# EAGLE design DOORLOCK_v4 (EAGLE 7.6.0)

## Sheet 1 of 2
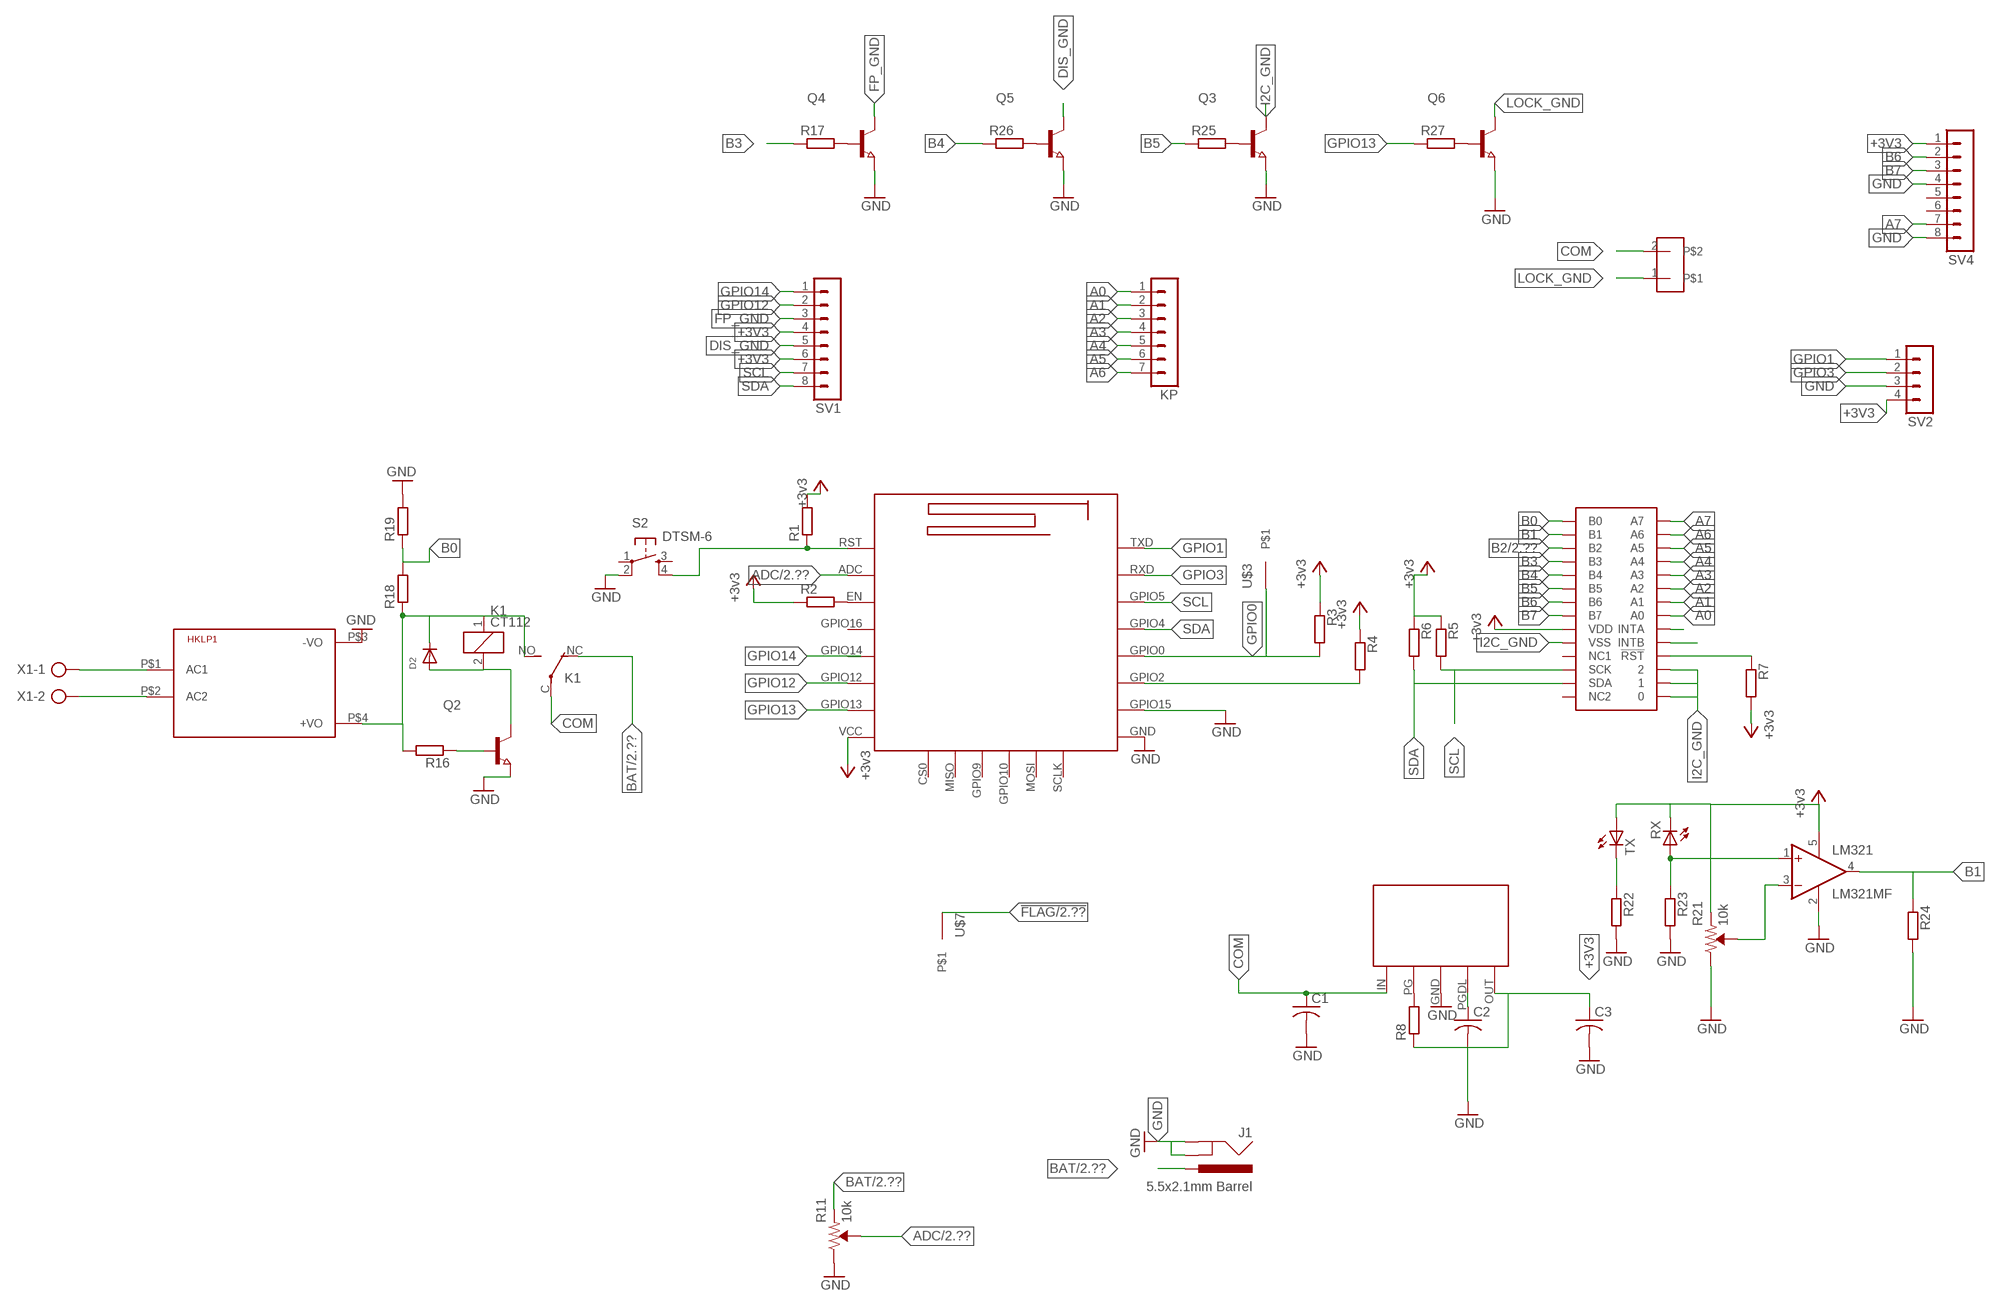
[diagram p0: schematic, sheet 1]

### Parts
C1  C-USC1206  [C1206]
C2  C-USC1206  [C1206]
C3  C-USC1206  [C1206]
D2  DIODESOD-123  [SOD-123]
HKLP1  HKLPM01  [HKLPM01]
J1  5.5x2.1mm Barrel  POWER_JACKSMD  [POWER_JACK_SMD]
K1  CT112  [CT-SLIM]
KP  MA07-1  [MA07-1]
LM321  LM321MF  [SOT23-5]
MCP23017  MCF23017  [MAX23017]
MP2014  MP2014  [MP2014]
Q2  NPN-TRANSISTOR_SOT89  [SOT89]
Q3  NPN-TRANSISTOR_SOT89  [SOT89]
Q4  NPN-TRANSISTOR_SOT89  [SOT89]
Q5  NPN-TRANSISTOR_SOT89  [SOT89]
Q6  NPN-TRANSISTOR_SOT89  [SOT89]
R1  R-EU_0204/2V  [0204V]
R2  R-EU_0204/2V  [0204V]
R3  R-EU_0204/2V  [0204V]
R4  R-EU_0204/2V  [0204V]
R5  R-EU_0204/2V  [0204V]
R6  R-EU_0204/2V  [0204V]
R7  R-EU_0204/2V  [0204V]
R8  R-EU_0204/2V  [0204V]
R11  10k  TRIMPOT-SMD-3MM-OPEN-1/10W-25%  [TRIMPOT-SMD-TC33X]
R16  R-EU_0204/2V  [0204V]
R17  R-EU_0204/2V  [0204V]
R18  R-EU_0204/2V  [0204V]
R19  R-EU_0204/2V  [0204V]
R21  10k  TRIMPOT-SMD-3MM-OPEN-1/10W-25%  [TRIMPOT-SMD-TC33X]
R22  R-EU_0204/2V  [0204V]
R23  R-EU_0204/2V  [0204V]
R24  R-EU_0204/2V  [0204V]
R25  R-EU_0204/2V  [0204V]
R26  R-EU_0204/2V  [0204V]
R27  R-EU_0204/2V  [0204V]
RX  LED5MM  [LED5MM]
S2  DTSM-6  [DTSM-6]
SV1  MA08-1  [MA08-1]
SV2  MA04-1  [MA04-1]
SV4  MA08-1  [MA08-1]
TX  LED5MM  [LED5MM]
U$1  ESP12E  [ESP-12E]
U$3  M1  [M1]
U$4  MALE2PIN  [MALE2PIN]
U$7  M1  [M1]
X1  AK500/2-H  [AK500/2-H]

### Nets
!FLAG [GPIO]: U$7.P$1 ; also sheet 2
+3V3 [GPIO]: C3.1 LM321.5(V+) MCP23017.P$9(VDD) MP2014.OUT R1.2 R2.1 R3.1 R4.1 R5.1 R6.1 R7.2 R8.1 R21.3(CCW) RX.K(C) SV1.4 SV1.6 SV2.4 SV4.1 TX.A U$1.VCC ; supply symbol labelled +3v3
+12V: D2.C HKLP1.P$4(+VO) K1.1 K1.NO(2:S) R16.2 R18.1 ; also sheet 2
A0 [GPIO]: KP.1 MCP23017.P$21(A0)
A1 [GPIO]: KP.2 MCP23017.P$22(A1)
A2 [GPIO]: KP.3 MCP23017.P$23(A2)
A3 [GPIO]: KP.4 MCP23017.P$24(A3)
A4 [GPIO]: KP.5 MCP23017.P$25(A4)
A5 [GPIO]: KP.6 MCP23017.P$26(A5)
A6 [GPIO]: KP.7 MCP23017.P$27(A6)
A7 [GPIO]: MCP23017.P$28(A7) SV4.7
ADC [GPIO]: R11.2(WIPER) U$1.ADC ; also sheet 2
B0 [GPIO]: MCP23017.P$1(B0) R18.2 R19.1
B1 [GPIO]: LM321.4(OUT) MCP23017.P$2(B1) R24.1
B2 [GPIO]: MCP23017.P$3(B2) ; also sheet 2
B3 [GPIO]: MCP23017.P$4(B3) R17.1
B4 [GPIO]: MCP23017.P$5(B4) R26.1
B5 [GPIO]: MCP23017.P$6(B5) R25.1
B6 [GPIO]: MCP23017.P$7(B6) SV4.2
B7 [GPIO]: MCP23017.P$8(B7) SV4.3
BAT [GPIO]: J1.VIN0(PWR) K1.NC(2:O) R11.3(CCW) ; also sheet 2
COM [GPIO]: C1.1 K1.C(2:P) MP2014.IN U$4.2
DIS_GND [GPIO]: Q5.2(C) SV1.5
FP_GND [GPIO]: Q4.2(C) SV1.3
GND [GPIO]: C1.2 C2.2 C3.2 HKLP1.P$3(-VO) J1.GND(GNDBREAK) J1.P$4(GND) LM321.2(V-) MP2014.GND Q2.3(E) Q3.3(E) Q4.3(E) Q5.3(E) Q6.3(E) R11.1(CW) R19.2 R21.1(CW) R22.2 R23.2 R24.2 S2.2 SV2.3 SV4.4 SV4.8 U$1.GND U$1.GPIO15 ; also sheet 2
GPIO0 [GPIO]: R3.2 U$1.GPIO0 U$3.P$1
GPIO1 [GPIO]: SV2.1 U$1.TXD
GPIO3 [GPIO]: SV2.2 U$1.RXD
GPIO12 [GPIO]: SV1.2 U$1.GPIO12
GPIO13 [GPIO]: R27.1 U$1.GPIO13
GPIO14 [GPIO]: SV1.1 U$1.GPIO14
I2C_GND [GPIO]: MCP23017.P$10(VSS) MCP23017.P$15 MCP23017.P$16 MCP23017.P$17 Q3.2(C)
LOCK_GND: Q6.2(C) U$4.1
N$1 [GPIO]: R1.1 S2.4 U$1.RST
N$2: R2.2 U$1.EN
N$3 [AC]: HKLP1.P$1(AC1) X1.1
N$4 [GPIO]: R4.2 U$1.GPIO2
N$5 [GPIO]: LM321.3(-IN) R21.2(WIPER)
N$6: Q3.1(B) R25.2
N$7 [AC]: HKLP1.P$2(AC2) X1.2
N$9 [GPIO]: MCP23017.P$18(!RST) R7.1
N$10: MCP23017.P$19(INTB)
N$11: MCP23017.P$20(INTA)
N$12: MP2014.PG R8.2
N$13: C2.1 MP2014.PGDL
N$15: Q2.1(B) R16.1
N$16: Q6.1(B) R27.2
N$26: D2.A K1.2 Q2.2(C)
N$28: Q4.1(B) R17.2
N$30 [GPIO]: R22.1 TX.K(C)
N$31: Q5.1(B) R26.2
N$33 [GPIO]: LM321.1(+IN) R23.1 RX.A
SCL [GPIO]: MCP23017.P$12(SCK) R5.2 SV1.7 U$1.GPIO5
SDA [GPIO]: MCP23017.P$13(SDA) R6.2 SV1.8 U$1.GPIO4
Unconnected: MCP23017.P$11(NC1) MCP23017.P$14(NC2) S2.1 S2.3 SV4.5 SV4.6 U$1.CS0 U$1.GPIO9 U$1.GPIO10 U$1.GPIO16 U$1.MISO U$1.MOSI U$1.SCLK

## Sheet 2 of 2
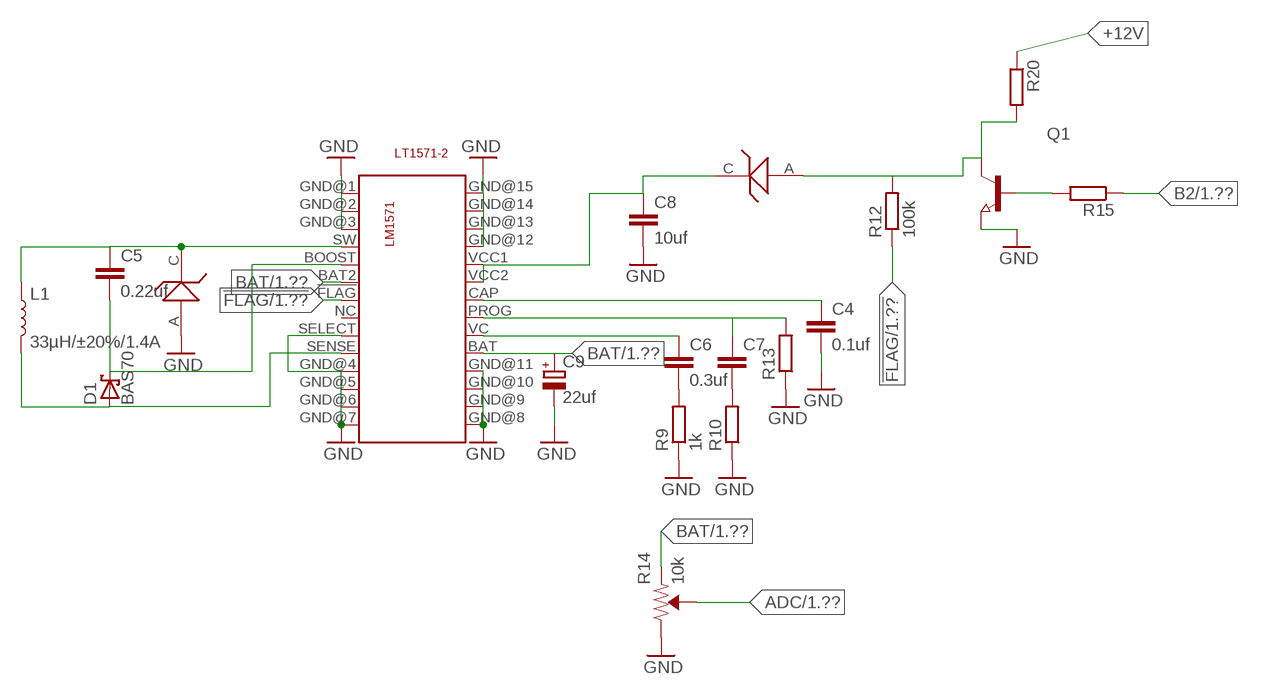
[diagram p1: schematic, sheet 2]

### Parts
C4  0.1uf  C-EUC0805  [C0805]
C5  0.22uf  C-EUC0805  [C0805]
C6  0.3uf  C-EUC0805  [C0805]
C7  C-EUC0805  [C0805]
C8  10uf  C-EUC0805  [C0805]
C9  22uf  CPOL-EUCT3216  [CT3216]
D1  BAS70  [SOT23]
D3  MBRM120T3  [MBRM120T3]
L1  33µH/±20%/1.4A  INDUCTOR-SRN6045-33UH  [SRN6045]
LT1571-2  LM1571  [LT1571]
Q1  NPN-TRANSISTOR_SOT89  [SOT89]
R9  1k  R-EU_0204/2V  [0204V]
R10  R-EU_0204/2V  [0204V]
R12  100k  R-EU_0204/2V  [0204V]
R13  R-EU_0204/2V  [0204V]
R14  10k  TRIMPOT-SMD-3MM-OPEN-1/10W-25%  [TRIMPOT-SMD-TC33X]
R15  R-EU_0204/2V  [0204V]
R20  R-EU_0204/2V  [0204V]
U$6  MBRM120T3  [MBRM120T3]

### Nets
!FLAG [GPIO]: LT1571-2.!FLAG R12.1 ; also sheet 1
+12V: R20.1 ; also sheet 1
ADC [GPIO]: R14.2(WIPER) ; also sheet 1
B2 [GPIO]: R15.1 ; also sheet 1
BAT [GPIO]: C9.+ LT1571-2.BAT LT1571-2.BAT2 R14.3(CCW) ; also sheet 1
GND [GPIO]: C4.2 C8.2 C9.- LT1571-2.GND@1 LT1571-2.GND@2 LT1571-2.GND@3 LT1571-2.GND@4 LT1571-2.GND@5 LT1571-2.GND@6 LT1571-2.GND@7 LT1571-2.GND@8 LT1571-2.GND@9 LT1571-2.GND@10 LT1571-2.GND@11 LT1571-2.GND@12 LT1571-2.GND@13 LT1571-2.GND@14 LT1571-2.GND@15 LT1571-2.SELECT Q1.3(E) R9.1 R10.1 R13.1 R14.1(CW) U$6.A ; also sheet 1
N$8 [GPIO]: Q1.1(B) R15.2
N$14: C8.1 D3.C LT1571-2.VCC1 LT1571-2.VCC2
N$17 [GPIO]: C4.1 LT1571-2.CAP
N$18: D3.A Q1.2(C) R12.2 R20.2
N$19: D1.1(A) L1.2 LT1571-2.SENSE
N$20: C5.1 L1.1 LT1571-2.SW U$6.C
N$21: C5.2 D1.3(C) LT1571-2.BOOST
N$22: C6.2 R9.2
N$23 [GPIO]: C6.1 LT1571-2.VC
N$24: C7.2 R10.2
N$25 [GPIO]: C7.1 LT1571-2.PROG R13.2
Unconnected: LT1571-2.NC

## Library data of the parts
C1-C3 = adafruit:C-US: CAPACITOR, American symbol
C4-C8 = rcl:C-EU: CAPACITOR, European symbol
C9 = rcl:CPOL-EU: POLARIZED CAPACITOR, European symbol
D1 = diode:BAS70: Silicon Schottky Diodes General-purpose diode for high-speed switching
D2 = adafruit:DIODE: Diode SMADIODE - SMA Surface Mount Package 20V 1A Schottky Diode Digikey: 641-1014-6-ND DO-1N4148 - Through Hole Small Current Diode SOD-123 20V 1 A (.5mV Vf) Schottky Diode - Digikey: MBRX120TPMSCT-ND SOD-323 10V 570mA (.38mV Vf, 3ns) Schottky Diode - Digikey: ZLLS410CT-ND SOD-523 30V 30mA Schottky Diode (RB751S-40TE61) - Digikey: RB751S-40TE61CT-ND SOT23-R/W - SOT23 Package (R = Solder Paste/Reflow Ovens, W = Hand-Soldering) BAT54Film 40V 300mA - Digikey: 497-7162-1-ND
D3 U$6 = Alfred:MBRM120T3
HKLP1 = HKLPM01:HKLPM01
J1 = SparkFun-Connectors:POWER_JACK: Power Jack Connector This is the standard 5.5mm barrel jack for power. The PTH is the most common, proven, reliable, footprint. The Slot footprint only works if the mill layer is transmitted to the PCB fab house so be warned. Here are the connectors we sell at SparkFun: DC Barrel Power Jack/Connector <https://www.sparkfun.com/products/119> (PRT-00119) DC Barrel Power Jack/Connector (SMD) <https://www.sparkfun.com/products/12748> (PRT-12748) DC Barrel Jack Adapter - Breadboard Compatible <https://www.sparkfun.com/products/10811> (PRT-10811) It is used on this SparkFun product (and many, many others): SparkFun RedBoard - Programmed with Arduino <https://www.sparkfun.com/products/12757> (DEV-12757) Also, if you need a mating power supply or connector, please check these out: Wall Adapter Power Supply - 9VDC 650mA <https://www.sparkfun.com/products/298> (TOL-00298) DC Barrel Jack Adapter - Male <https://www.sparkfun.com/products/10287> (PRT-10287); PROD_ID: CONN-08106; SF_ID: PRT-12748
K1 = relay:CT112: ULTRA SMALL AUTOMOTIVE RELAY NAiS Slim 1c type en_ds_61205_0000.pdf; OC_FARNELL: unknown; OC_NEWARK: unknown
KP = con-lstb:MA07-1: PIN HEADER; OC_FARNELL: unknown; OC_NEWARK: unknown
L1 = SparkFun-Coils:INDUCTOR: Inductors Resist changes in electrical current. Basically a coil of wire. SparkFun Products: SparkFun Load Cell Amplifier - HX711 <https://www.sparkfun.com/products/13879> IOIO-OTG - V2.2 <https://www.sparkfun.com/products/13613>; PROD_ID: NDUC-11627
LM321 = linear:LM321?*: Low Power Single Op Amp Source: http://cache.national.com/ds/LM/LM321.pdf
LT1571-2 = Alfred:LM1571
MCP23017 = Alfred:MCF23017
MP2014 = Alfred:MP2014
Q1-Q6 = semicon-smd-ipc:NPN-TRANSISTOR_: NPN TRANSISTOR
R1-R8 R16-R19 R22-R27 = resistor:R-EU_: RESISTOR, European symbol
R9 R10 R12 R13 R15 R20 = rcl:R-EU_: RESISTOR, European symbol
R11 R14 R21 = SparkFun-Resistors:TRIMPOT: Trimming Potentiometer (Trimpot) Three-terminal potentiometers, with an adjustable wiper and two adjustable resistors. A pot can be used to create a configurable voltage divider, or as a variable resistor. "Trimpots" are a subset of potentiometers, usually intended for "set-and-forget" applications. They're often more delicate than standard potentiometers - rated for fewer turns. Variants PTH-KNOB - PTH Trimpot w/ finger-adjustable knob Trimpot 10K with Knob <https://www.sparkfun.com/products/9806> (COM-09806) Datasheet <http://www.sparkfun.com/datasheets/Components/General/TSR-3386.pdf> SMD-3MM-CLOSED-FRAME - SMD 3mm Square Closed-Frame Trimpot Used on e.g. EasyDriver - Stepper Motor Driver <https://www.sparkfun.com/products/12779> Datasheet <http://www.bitechnologies.com/pdfs/22.pdf> (22AR10KTR) SMD-5MM - SMD 5mm Square Closed-Frame Trimpot Used on e.g. IOIO-OTG - V2.2 <https://www.sparkfun.com/products/13613> Datasheet <http://www.vishay.com/docs/51008/ts53.pdf> (TS53YL502MR10) SMD-3MM-1/10W-25% - 3mm Square Open-Frame Trimpot Used on e.g. SparkFun Shapeoko <https://www.sparkfun.com/products/13899> Datasheet <http://www.bourns.com/docs/Product-Datasheets/TC33.pdf> (TC33X-2-103E); PROD_ID: RES-12428
RX TX = adafruit:LED: LED OSRAM: - CHIPLED LG R971, LG N971, LY N971, LG Q971, LY Q971, LO R971, LY R971 LH N974, LH R974 LS Q976, LO Q976, LY Q976 LO Q996 - Hyper CHIPLED LW Q18S LB Q993, LB Q99A, LB R99A - SideLED LS A670, LO A670, LY A670, LG A670, LP A670 LB A673, LV A673, LT A673, LW A673 LH A674 LY A675 LS A676, LA A676, LO A676, LY A676, LW A676 LS A679, LY A679, LG A679 - Hyper Micro SIDELED® LS Y876, LA Y876, LO Y876, LY Y876 LT Y87S - SmartLED LW L88C, LW L88S LB L89C, LB L89S, LG L890 LS L89K, LO L89K, LY L89K LS L896, LA L896, LO L896, LY L896 - TOPLED LS T670, LO T670, LY T670, LG T670, LP T670 LSG T670, LSP T670, LSY T670, LOP T670, LYG T670 LG T671, LOG T671, LSG T671 LB T673, LV T673, LT T673, LW T673 LH T674 LS T676, LA T676, LO T676, LY T676, LB T676, LH T676, LSB T676, LW T676 LB T67C, LV T67C, LT T67C, LS T67K, LO T67K, LY T67K, LW E67C LS E67B, LA E67B, LO E67B, LY E67B, LB E67C, LV E67C, LT E67C LW T67C LS T679, LY T679, LG T679 LS T770, LO T770, LY T770, LG T770, LP T770 LB T773, LV T773, LT T773, LW T773 LH T774 LS E675, LA E675, LY E675, LS T675 LS T776, LA T776, LO T776, LY T776, LB T776 LHGB T686 LT T68C, LB T68C - Hyper Mini TOPLED® LB M676 - Mini TOPLED Santana® LG M470 LS M47K, LO M47K, LY M47K Source: http://www.osram.convergy.de/
S2 = switch-tact:DTSM-6
SV1 SV4 = con-lstb:MA08-1: PIN HEADER; OC_FARNELL: unknown; OC_NEWARK: unknown
SV2 = con-lstb:MA04-1: PIN HEADER; OC_FARNELL: unknown; OC_NEWARK: unknown
U$1 = Alfred:ESP12E
U$3 U$7 = Alfred:M1
U$4 = Alfred:MALE2PIN
X1 = con-ptr500:AK500/2-H: CONNECTOR Aug. 2004 / PTR Meßtechnik: Die Bezeichnung der Serie AK505 wurde geändert. Es handelt sich hierbei um AK500 in horizontaler Ausführung.; OC_FARNELL: unknown; OC_NEWARK: unknown

## Net classes
0 default: width 0.381 mm, drill 0.7 mm, clearance 0.203 mm
1 AC: width 1 mm, drill 0.7 mm, clearance 0.203 mm to class 0, clearance 0.203 mm
2 GPIO: width 0.254 mm, drill 0.7 mm, clearance 0.203 mm to class 0, clearance 0.203 mm to class 1, clearance 0.203 mm
3 zerocross: width 0.35 mm, drill 0.7 mm, clearance 0.203 mm to class 0, clearance 0.203 mm to class 1, clearance 0.203 mm to class 2, clearance 0.203 mm

## Board
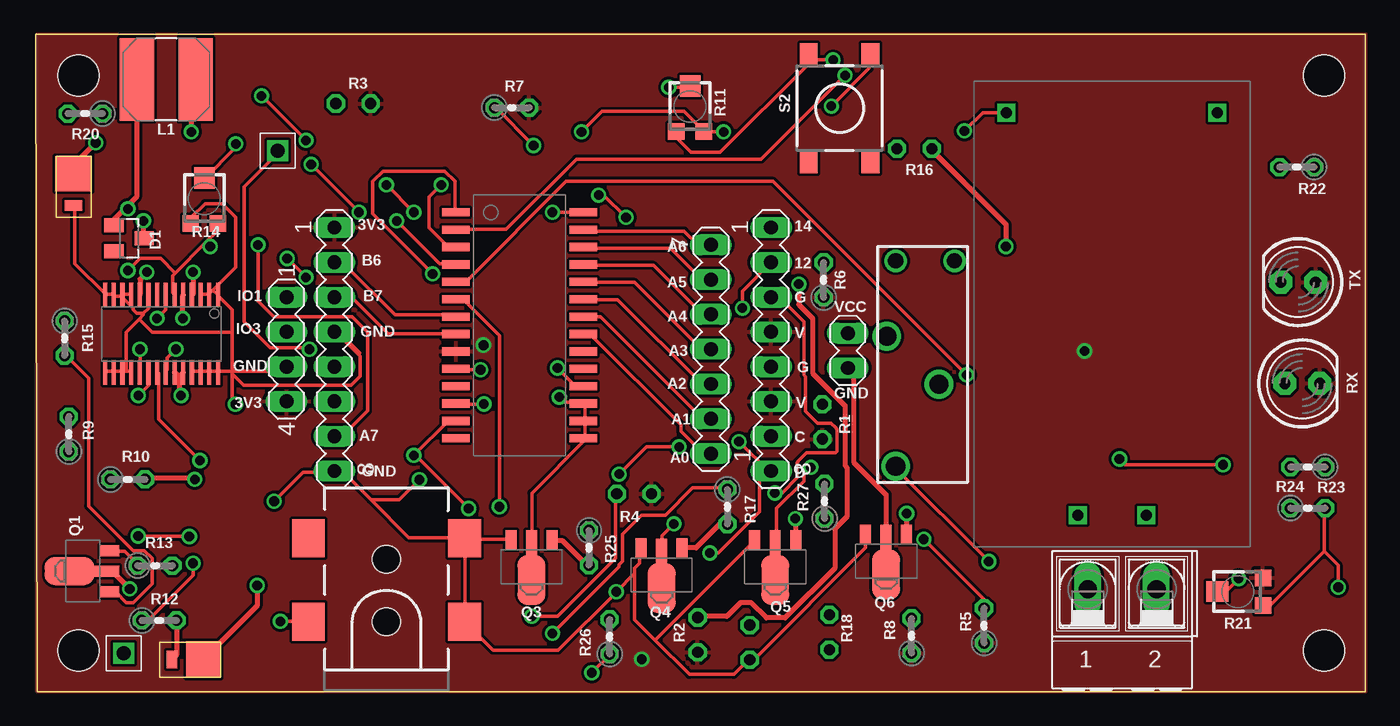
[diagram p2: board, top side]
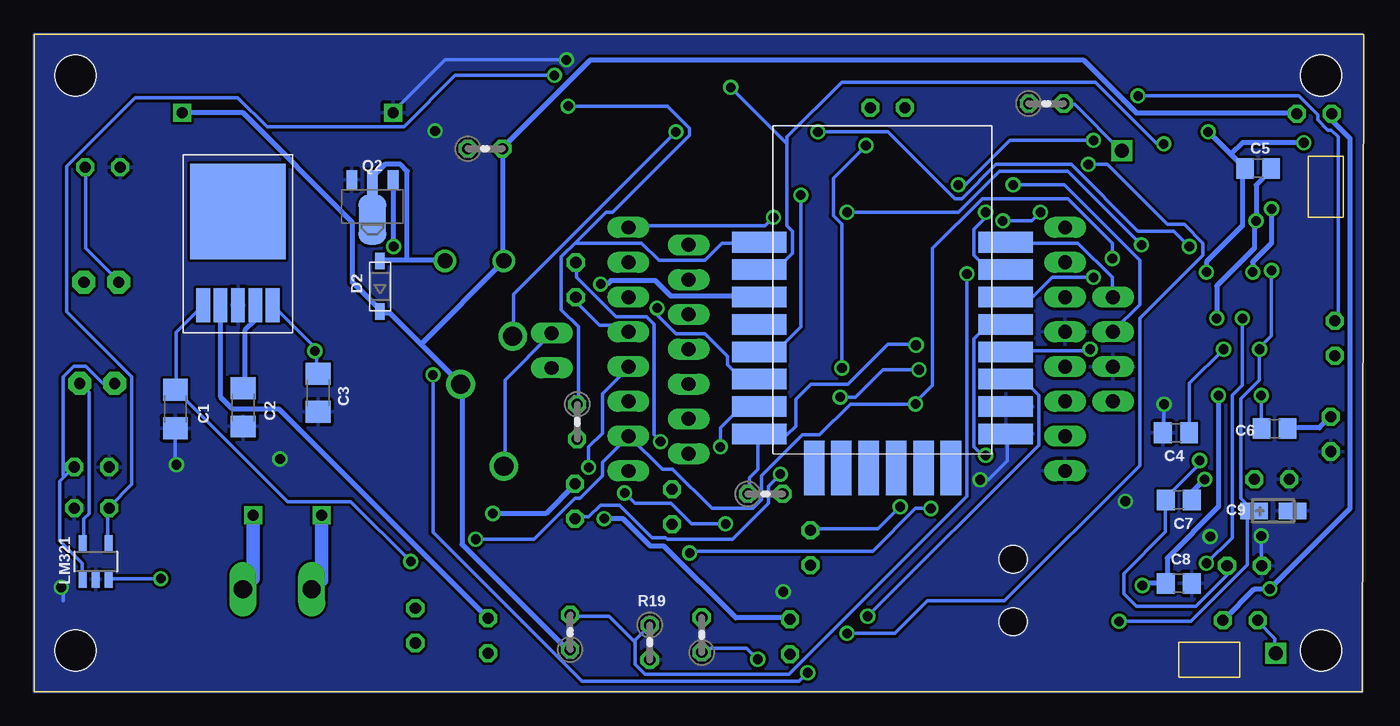
[diagram p3: board, bottom side, seen from below]

Size 97.1 x 48 mm. Coordinates in mm from the lower left corner, seen from the top.
Outline: 0,48 0.1,0 97.1,0 97.1,48 0,48
Copper layers (1*16): Top 0.035mm / dielectric 1.5mm / Bottom 0.035mm
Design rules "default *": minimum track width 0.2mm, minimum drill 0.4mm, track to track 0.1mm, track to pad 0.1mm, pad to pad 0.1mm, via to via 0.1mm, smd to smd 0.1mm, copper to edge 0mil, drill to drill 8mil, minimum pad ring 10mil, minimum via ring 8mil, stop-mask expansion 4mil, vias tented up to drill 0mil, thermal gap 10mil
Holes 3 mm at 94.1,45 3.1,45 3.1,3 94.1,3

### Footprints (pad centres in the part's own frame; a part is rotated, then mirrored left to right if it is on the bottom)
C1206 = smd 1.6 x 1.8: 1 -1.4,0; 2 1.4,0
C0805 = smd 1.3 x 1.5: 1 -0.95,0; 2 0.95,0
CT3216 = smd 2 x 1.2: + -1.4,0; - 1.4,0
SOT23 = smd 1 x 1.4: 1 -0.95,-1.1; 2 0.95,-1.1; 3 0,1.1
SOD-123 = smd 1.2 x 0.7: A 1.85,0; C -1.85,0
MBRM120T3 = smd 0.762 x 1.27: A 3.575,1.27 | smd 2.54 x 2.67: C 1.27,1.27
HKLPM01 = drill 0.8 square: P$1 -14.7,2.5; P$2 -14.7,-2.5; P$3 14.7,7.7; P$4 14.7,-7.7
POWER_JACK_SMD = smd 2.8 x 2.4: GND 0,-5.7; P$4 6.1,-5.7; VIN0 0,5.7; VIN1 6.1,5.7 | hole 2.032: 0,0; 4.572,0
CT-SLIM = drill 1.1: 1 -7.45,0; 2 -7.45,4.3 | drill 1.4: C 7.55,0; NC -1.95,-0.65; NO 1.55,3.15
MA07-1 = drill 1.016 long: 1 -7.62,0; 2 -5.08,0; 3 -2.54,0; 4 0,0; 5 2.54,0; 6 5.08,0; 7 7.62,0
SRN6045 = smd 2.5 x 6: 1 -2.175,0; 2 2.125,0
SOT23-5 = smd 0.6 x 1.2: 1 -0.95,-1.306; 2 0,-1.306; 3 0.95,-1.306; 4 0.95,1.306; 5 -0.95,1.306
LT1571 = smd 0.3 x 1.8: !FLAG 3.81,-0.864; BAT 5.715,4.809; BAT2 3.175,-0.864; BOOST 2.54,-0.864; CAP 3.81,4.809; GND@1 0,-0.864; GND@2 0.635,-0.864; GND@3 1.27,-0.864; GND@4 6.35,-0.864; GND@5 6.985,-0.864; GND@6 7.62,-0.864; GND@7 8.255,-0.864; GND@8 8.255,4.809; GND@9 7.62,4.809; GND@10 6.985,4.809; GND@11 6.35,4.809; GND@12 1.905,4.809; GND@13 1.27,4.809; GND@14 0.635,4.809; GND@15 0,4.809; NC 4.445,-0.864; PROG 4.445,4.809; SELECT 5.08,-0.864; SENSE 5.715,-0.864; SW 1.905,-0.864; VC 5.08,4.809; VCC1 2.54,4.809; VCC2 3.175,4.809
MAX23017 = smd 0.6 x 2: P$1 0,0; P$2 1.27,0; P$3 2.54,0; P$4 3.81,0; P$5 5.08,0; P$6 6.35,0; P$7 7.62,0; P$8 8.89,0; P$9 10.16,0; P$10 11.43,0; P$11 12.7,0; P$12 13.97,0; P$13 15.24,0; P$14 16.51,0; P$15 16.51,9.3; P$16 15.24,9.3; P$17 13.97,9.3; P$18 12.7,9.3; P$19 11.43,9.3; P$20 10.16,9.3; P$21 8.89,9.3; P$22 7.62,9.3; P$23 6.35,9.3; P$24 5.08,9.3; P$25 3.81,9.3; P$26 2.54,9.3; P$27 1.27,9.3; P$28 0,9.3
MP2014 = smd 1 x 2.5: GND 0,0; IN -2.54,0; OUT 2.54,0; PG -1.27,0; PGDL 1.27,0 | smd 7 x 7: P$6 0,6.85
SOT89 = smd 0.8 x 1.4: 1 -1.499,-1.981; 3 1.499,-1.981 | smd 0.8 x 1.9: 2 0,-1.727 | smd 2.032 x 3.65: 2@1 0,0.94
0204V = drill 0.813 octagon: 1 -1.27,0; 2 1.27,0
TRIMPOT-SMD-TC33X = smd 1.2 x 1.2: 1 -1,-1.825; 3 1,-1.825 | smd 1.5 x 1.6: 2 0,1.5
LED5MM = drill 0.813 pad 1.676 octagon: A -1.27,0; K 1.27,0
DTSM-6 = smd 1.55 x 1.3: 1 -3.975,2.25; 2 3.975,2.25; 3 -3.975,-2.25; 4 3.975,-2.25
MA08-1 = drill 1.016 long: 1 -8.89,0; 2 -6.35,0; 3 -3.81,0; 4 -1.27,0; 5 1.27,0; 6 3.81,0; 7 6.35,0; 8 8.89,0
MA04-1 = drill 1.016 long: 1 -3.81,0; 2 -1.27,0; 3 1.27,0; 4 3.81,0
ESP-12E = smd 4 x 1.5: ADC -8.62,3.32; EN -8.62,1.32; GND 9.38,-8.68; GPIO0 9.38,-2.68; GPIO2 9.38,-4.68; GPIO4 9.38,-0.68; GPIO5 9.38,1.32; GPIO12 -8.62,-4.68; GPIO13 -8.62,-6.68; GPIO14 -8.62,-2.68; GPIO15 9.38,-6.68; GPIO16 -8.62,-0.68; RST -8.62,5.32; RXD 9.38,3.32; TXD 9.38,5.32; VCC -8.62,-8.68 | smd 1.5 x 4: CS0 -4.62,-11.16; GPIO9 -0.62,-11.16; GPIO10 1.38,-11.16; MISO -2.62,-11.16; MOSI 3.38,-11.16; SCLK 5.38,-11.16
M1 = drill 1.016 square: P$1 0,0
MALE2PIN = drill 1.016 long: 1 0,1.27; 2 0,-1.27
AK500/2-H = drill 1.321 long: 1 -2.515,0; 2 2.515,0

### Placement (x,y rotation side)
C1  86.79,20.64 270 bottom
C2  81.84,20.76 270 bottom
C3  76.36,21.82 270 bottom
C4  13.7,18.9 180 bottom
C5  7.7,38.2 0 bottom
C6  6.5,19.2 0 bottom
C7  13.5,14 0 bottom
C8  13.5,7.9 0 bottom
C9  6.6,13.2 0 bottom
D1  6.8,33.1 270 top
D2  71.84,29.59 90 bottom
D3  13.5,3.6 180 top
HKLP1  78.6,27.58 90 top
J1  25.6,5.1 90 top
K1  62.8,24 270 top
KP  49.3,25 90 top
L1  9.5,44.7 180 top
LM321  92.6,9.5 0 bottom
LT1571-2  13.3,28.1 180 top
MCP23017  30.68,35 270 top
MP2014  82.22,28.21 0 bottom
Q1  3.4,8.8 90 top
Q2  72.4,35.4 180 bottom
Q3  36.2,9.1 180 top
Q4  45.7,8.5 180 top
Q5  54,9.1 180 top
Q6  62.1,9.5 180 top
R1  57.44,19.71 270 bottom
R2  48.34,4.14 90 bottom
R3  23.18,42.94 0 bottom
R4  43.7,14.44 0 bottom
R5  69.26,4.82 90 top
R6  57.54,30.06 90 top
R7  34.76,42.64 0 top
R8  63.96,4.08 90 top
R9  2.4,18.8 90 top
R10  6.7,15.5 0 top
R11  47.78,42.72 0 top
R12  9,5.2 0 top
R13  8.7,9.2 0 top
R14  12.3,36 0 top
R15  2.1,25.8 270 top
R16  64.17,39.64 0 bottom
R17  50.5,13.5 270 top
R18  57.96,4.33 90 bottom
R19  52.14,3.59 270 bottom
R20  3.6,42.2 180 top
R21  87.8,7.3 90 top
R22  92.1,38.3 180 top
R23  92.9,16.4 180 top
R24  92.9,13.4 0 top
R25  40.4,10.5 270 top
R26  41.9,4 90 top
R27  57.6,13.9 90 top
RX  92.5,22.5 0 top
S2  58.7,42.6 90 top
SV1  53.7,25 270 top
SV2  18.3,25 270 top
SV4  21.8,25 270 top
TX  92.2,29.9 180 top
U$1  35.52,27.49 0 bottom
U$3  17.66,39.49 90 top
U$4  59.3,24.9 180 top
U$6  1.48,39.08 270 top
U$7  6.4,2.8 0 top
X1  79.34,7.47 0 top

### Tracks (layer width: path | path; a pad name or v marks a point on that pad's centre or on a via)
!FLAG  (via drill 0.7)
  Top 0.254: v8.85,27.25 9.47,27.88 9.47,28.88 LT1571-2.!FLAG | v11.47,9.38 11.47,8.5 8.22,5.25 7.85,5.25 R12.1
  Bottom 0.254: v8.85,27.25 8.85,22.38 9.6,21.62 9.6,11.25 v11.47,9.38 | U$7.P$1 6.47,2.88 6.47,3.88 7.72,5.12 R12.1
+3V3  (via drill 0.7, 0.71)
  Top 0.254: 48.6,2.82 48.6,3 R2.1 48.36,2.86 48.29,2.82 | v32.69,25.3 32.61,25.3 32.59,25.32
  Bottom 0.254: 76.47,24.88 76.47,25 79.6,28.12 MP2014.OUT | 76.47,24.88 76.47,23.25 C3.1 | LM321.5 93.47,10.88 93.47,12.62 93.1,13 93.1,21.88 93.72,22.5 RX.K | 44.23,18.75 44.23,16.25 44.85,15.62 44.85,14.5 R4.1 | 44.23,18.75 U$1.VCC | v76.6,24.88 76.47,24.88 | R6.1 57.54,28.48 55.8,26.75 54.18,26.75 SV1.4 | 44.22,2.36 v44.25,2.36 45.06,3.17 48.34,3.17 R2.1 | 44.23,18.75 42.11,18.75 41.48,19.38 41.48,21.34 40.36,22.45 37.67,22.45 34.75,25.38 32.76,25.38 v32.69,25.3
  pour Top: 97.1,48 97.1,0 0.1,0 0.1,48
+12V
  Bottom 0.381: 68.85,25.38 65.97,22.5 K1.NO 65.85,22.38 65.85,10.75 58.23,3.12 57.98,3.12 R18.1 | 68.85,25.38 71.1,27.62 71.72,27.62 D2.C 71.85,27.88 73.85,29.88 73.85,34.25 81.85,42.25 86.22,42.25 HKLP1.P$4 | R20.1 4.97,42.25 16.6,42.25 20.48,46.12 56.48,46.12 62.85,39.75 R16.2 62.85,39.62 62.85,31.5 K1.1 62.85,31.38 68.85,25.38
A0
  Top 0.254: MCP23017.P$21 40.1,26 40.6,26 47.1,19.5 47.1,19 48.6,17.5 49.23,17.5 KP.1
A1
  Top 0.254: MCP23017.P$22 40.1,27.38 41.23,27.38 48.6,20 49.23,20 KP.2
A2
  Top 0.254: MCP23017.P$23 40.1,28.62 42.48,28.62 48.6,22.5 49.23,22.5 KP.3
A3
  Top 0.254: KP.4 48.6,25 43.73,29.88 40.1,29.88 MCP23017.P$24
A4
  Top 0.254: MCP23017.P$25 40.1,31.12 45.1,31.12 48.6,27.62 49.23,27.62 KP.5
A5
  Top 0.254: MCP23017.P$26 40.1,32.38 46.35,32.38 48.6,30.12 49.23,30.12 KP.6
A6
  Top 0.254: MCP23017.P$27 40.1,33.62 47.35,33.62 48.35,32.62 49.23,32.62 KP.7
A7  (via drill 0.7)
  Top 0.254: v37.73,35 MCP23017.P$28 | v16.23,32.62 16.23,28.5 17.35,27.38 23.1,27.38 24.23,26.25 24.23,20.5 22.48,18.75 21.85,18.75 SV4.7
  Bottom 0.254: v37.73,35 29.6,35 26.6,38 21.6,38 v16.23,32.62
ADC  (via drill 0.7)
  Top 0.254: v14.6,40 14.6,39.75 12.35,37.5 R14.2 | v46.23,44.12 47.73,44.12 R11.2
  Bottom 0.254: v14.6,40 15.1,40 19.6,44.5 38.1,44.5 42.1,40.5 42.1,40.12 | 42.1,40.12 42.1,34 41.73,33.62 41.73,32 42.85,30.88 44.1,30.88 U$1.ADC | v46.23,44.12 42.23,40.12 42.1,40.12
B0  (via drill 0.7)
  Top 0.254: v28.98,30.5 24.6,34.88 24.6,37.25 25.35,38 29.85,38 30.6,37.25 30.6,35 MCP23017.P$1
  Bottom 0.254: v28.98,30.5 28.98,14.25 41.98,1.25 52.48,1.25 53.23,2 53.23,3.75 | 53.23,3.75 52.23,4.75 R19.1 | R18.2 57.85,5.5 55.1,5.5 53.35,3.75 53.23,3.75
B1  (via drill 0.7)
  Top 0.254: v59.1,45 52.98,38.88 39.48,38.88 34.35,33.75 30.73,33.75 MCP23017.P$2
  Bottom 0.254: LM321.4 91.72,10.88 91.72,13.38 R24.1 91.6,13.5 89.97,15.12 89.97,23 94.72,27.75 94.72,38.38 89.72,43.38 82.22,43.38 80.1,41.25 70.1,41.25 66.35,45 v59.1,45
B2  (via drill 0.7)
  Top 0.254: v29.6,37 28.73,36.12 28.73,33.88 30.1,32.5 30.6,32.5 MCP23017.P$3 | v16.48,43.5 v19.73,40.25
  Bottom 0.254: v29.6,37 29.1,37 25.85,40.25 v19.73,40.25 | v16.48,43.5 4.72,43.5 3.35,42.12 3.35,41.75 2.6,41 2.35,41 1.85,40.5 1.85,27.38 2.1,27.12 R15.1
B3  (via drill 0.7)
  Top 0.254: v26.35,34.38 29.48,31.25 30.6,31.25 MCP23017.P$4 | v20.1,38.5 v23.6,35 | v37.73,4.25 42.6,9.12 42.6,9.25 42.85,9.5 42.85,11.5 44.23,12.88 45.98,12.88 47.98,14.88 50.48,14.88 R17.1
  Bottom 0.254: v26.35,34.38 24.23,34.38 v23.6,35 | v20.1,38.5 18.73,38.5 14.35,34.12 13.1,34.12 11.72,32.75 11.72,31.88 16.35,27.25 16.35,16.5 26.23,6.62 31.85,6.62 34.23,4.25 v37.73,4.25
B4  (via drill 0.7)
  Top 0.254: v67.97,23.12 53.85,37.25 38.73,37.25 31.48,30 30.73,30 MCP23017.P$5 | v40.6,1.38 41.85,2.62 R26.1
  Bottom 0.254: v67.97,23.12 67.97,11.62 57.1,0.75 41.23,0.75 v40.6,1.38
B5  (via drill 0.7)
  Top 0.254: v33.85,13.5 33.85,26 31.23,28.62 30.73,28.62 MCP23017.P$6
  Bottom 0.254: v33.85,13.5 35.48,11.88 40.35,11.88 R25.1
B6
  Top 0.254: MCP23017.P$7 30.6,27.5 26.23,27.5 22.48,31.25 21.85,31.25 SV4.2
B7
  Top 0.254: MCP23017.P$8 30.6,26.12 25.73,26.12 23.1,28.75 21.85,28.75 SV4.3
BAT  (via drill 0.7)
  Top 0.254: v50.23,40.88 48.85,40.88 R11.3 48.73,41 47.35,42.38 41.35,42.38 v39.85,40.88 | 10.16,30.56 9.97,30.38 9.97,29.12 10.1,29 LT1571-2.BAT2 | 10.16,30.56 12.41,32.81 | 12.41,32.81 13.22,33.62 13.22,34.12 R14.3 | v7.6,25 7.6,23.38 LT1571-2.BAT | v17.85,5.12 19.85,5.12 J1.VIN0 | 10.16,30.56 9.1,31.62 7.6,31.62 v6.72,30.75 | 12.41,32.81 v12.72,32.5
  Bottom 0.254: v50.23,40.88 62.1,29 62.1,26 K1.NC | v17.85,5.12 12.6,5.12 8.47,9.25 8.47,13.5 C9.+ 8.1,13.25 8.97,14.12 8.97,21.38 7.6,22.75 v7.6,25 7.6,25.12 6.72,26 v6.72,30.75 | v39.85,40.88 34.73,40.88 29.85,36 29.35,36 26.85,38.5 21.35,38.5 16.48,33.62 13.85,33.62 v12.72,32.5
COM  (via drill 0.7)
  Top 0.254: v69.6,9.5 62.73,16.38 K1.C
  Bottom 0.254: MP2014.IN 84.85,28.12 86.72,26.25 86.72,22.12 C1.1 86.72,22 78.6,13.88 73.97,13.88 v69.6,9.5 | U$4.2 59.35,26.12 62.73,22.75 62.73,16.5 K1.C
DIS_GND  (via drill 0.7)
  Top 0.254: v56.6,16.38 56.1,15.88 56.1,15.38 54.1,13.38 54.1,10.88 Q5.2
  Bottom 0.254: v56.6,16.38 56.6,17.88 55.6,18.88 55.6,21.75 53.73,23.62 SV1.5
FP_GND  (via drill 0.7)
  Top 0.254: v46.6,12.25 45.73,11.38 45.73,10.25 Q4.2 | v53.98,14.5 54.48,14.5 55.57,15.6 55.57,16.71 55.65,16.79 55.65,16.82 56.29,17.45 58.39,17.45 58.5,17.55 58.5,19.15 58.42,19.23 58.42,19.25 58.06,19.61 57.1,19.61 56.23,20.48 56.23,23 56.1,23.12 56.1,27 54.35,28.75 53.73,28.75 SV1.3
  Bottom 0.254: v46.6,12.25 49.1,12.25 50.6,13.75 53.23,13.75 v53.98,14.5
GND  (via drill 0.7, 0.71)
  Top 0.254: R11.1 46.85,40.88 46.85,40.38 47.85,39.38 49.98,39.38 56.35,45.75 56.35,46.5 S2.2 56.48,46.12 v58.23,46.12 | Q3.3 34.6,11.12 31.35,11.12 J1.P$4 | J1.P$4 31.35,11 31.35,5.12 J1.GND 33.38,3.02 38.15,3.02 42.39,7.26 v42.39,7.29 43.73,8.62 | LT1571-2.GND@8 5.1,23.38 5.6,23.38 LT1571-2.GND@9 5.72,23.38 6.22,23.38 LT1571-2.GND@10 6.35,23.38 6.6,23.38 | 6.6,23.38 6.85,23.38 LT1571-2.GND@11 | 5.1,29 5.6,29 LT1571-2.GND@6 5.72,28.88 6.22,28.88 | 5.1,29 LT1571-2.GND@7 | LT1571-2.GND@4 6.85,29 6.35,29 LT1571-2.GND@5 6.22,28.88 | 7.85,27.62 8.22,28 8.22,28.88 LT1571-2.SELECT | 7.85,27.62 7.35,27.62 7.1,27.88 7.1,28 6.22,28.88 | 6.6,23.38 6.6,26.25 7.54,27.19 | 7.54,27.19 7.85,27.5 7.85,27.62 | 12.6,29 12.91,29.31 | 12.91,29.31 14.6,31 14.6,34.62 13.6,35.62 12.35,35.62 11.35,34.62 11.35,34.25 R14.1 | 12.6,29 LT1571-2.GND@2 | 12.6,29 12.1,29 LT1571-2.GND@3 | 12.91,29.31 13.22,29 LT1571-2.GND@1 13.35,28.88 14.35,27.88 14.35,26.25 | LT1571-2.GND@12 11.47,23.38 11.97,23.38 LT1571-2.GND@13 12.1,23.38 12.6,23.38 LT1571-2.GND@14 12.72,23.38 13.22,23.38 LT1571-2.GND@15 13.35,23.38 14.35,23.38 | 94.1,10.25 90.22,6.38 89.72,6.38 R21.1 | 94.1,10.25 94.1,13.38 R24.2 | Q1.3 5.47,10.25 6.47,10.25 7.47,9.25 R13.1 | 43.73,8.62 43.73,5.25 45.23,3.75 | 45.23,3.75 47.73,1.25 50.98,1.25 52.1,2.38 R19.2 52.23,2.38 52.48,2.38 60.6,10.5 60.6,11.38 Q6.3 | Q4.3 44.1,10.38 44.1,9.38 43.73,9 43.73,8.62 | 45.23,3.75 52.48,11 Q5.3 | 14.35,23.38 17.98,23.38 18.23,23.62 SV2.3 | 14.35,23.38 14.35,26.25 | 7.54,27.19 8.47,26.25 14.35,26.25 | 24.48,13.99 22.48,16 21.87,16 21.85,16 | 24.48,13.99 27.23,11.25 31.23,11.25 J1.P$4
  Top 0.254: 21.85,16 SV4.8 | HKLP1.P$3 69.15,42.28 v67.82,40.95 | v86.71,16.56 79.58,16.56 v79.14,16.99 | 94.1,10.25 95.12,9.23 v95.12,7.62 | 5.1,29 2.84,31.26 2.84,35.6 U$6.A | v7.47,11.35 7.49,11.33 v11.2,11.33 | v14.58,20.98 14.35,21.21 14.35,23.22 | 14.35,23.22 14.35,23.38 | v28.02,15.47 26.54,13.99 24.48,13.99 | 23.57,24.71 23.57,24.59 23.67,24.49 23.67,23.04 23.01,22.38 15.19,22.38 14.35,23.22 | 21.85,16 19.5,16 v17.4,13.89
  Top 0.381: SV4.4 22.01,26.27 23.57,24.71
  Bottom 0.254: v58.23,46.12 67.1,46.12 70.85,42.38 HKLP1.P$3 | 12.45,8 12.6,8 C8.2 12.1,8 | 12.1,8 | v67.82,40.95 67.82,40.89 | C1.2 86.79,16.64 v86.71,16.56 | v79.14,16.99 79.14,17.07 79.09,17.12 | v95.12,7.62 94.97,7.47 94.97,6.63 | 7.47,9.25 7.47,9.26 v7.47,11.35 | v11.2,11.33 11.33,11.2 11.33,11.1 | C4.2 14.58,18.97 v14.58,20.98 | v28.02,15.47 27.41,15.47 26.03,16.84 26.03,18.7 U$1.GND 26.14,18.73 26.01,18.68 | v42.39,7.29 42.39,7.19 | v17.4,13.89 17.17,13.89 17.09,13.82
  pour Bottom: 97.1,48 97.1,0 0.1,0 0.1,48
GPIO0  (via drill 0.7)
  Top 0.254: v19.98,25 19.85,25.12 17.1,25.12 15.22,27 15.22,36.88 17.73,39.38 U$3.P$1
  Bottom 0.254: R3.2 21.85,42.88 21.1,42.88 17.73,39.5 U$3.P$1 | v19.98,25 20.1,24.88 26.1,24.88 U$1.GPIO0
GPIO1
  Bottom 0.254: SV2.1 18.35,28.88 18.35,30.25 20.85,32.75 26.1,32.75 U$1.TXD
GPIO3  (via drill 0.7)
  Top 0.254: v27.6,35 v25.6,37
  Bottom 0.254: v25.6,37 21.85,37 16.35,31.5 16.35,28.25 18.23,26.38 SV2.2 | v27.6,35 27.6,34.62 28.48,33.75 28.48,31.88 27.48,30.88 26.23,30.88 U$1.RXD
GPIO12  (via drill 0.7)
  Top 0.254: SV1.2 51.6,29.25 v51.6,28
  Bottom 0.254: v51.6,28 51.6,27.5 50.23,26.12 48.1,26.12 46.48,24.5 46.48,23.88 45.48,22.88 44.23,22.88 U$1.GPIO12
GPIO13  (via drill 0.7)
  Top 0.254: v42.6,15.88 44.6,17.88 v46.98,17.88
  Bottom 0.254: v42.6,15.88 43.48,15 43.48,13.75 46.1,11.12 50.85,11.12 50.98,11.25 51.98,11.25 54.35,13.62 55.73,13.62 56.6,12.75 57.6,12.75 R27.1 | v46.98,17.88 46.98,19.25 45.48,20.75 44.23,20.75 U$1.GPIO13
GPIO14  (via drill 0.7)
  Top 0.254: v43.1,34.62 41.48,36.25 v41.1,36.25
  Bottom 0.254: v43.1,34.62 43.73,34 53.6,34 SV1.1 | v41.1,36.25 41.1,26.62 42.85,24.88 44.1,24.88 U$1.GPIO14
I2C_GND  (via drill 0.7)
  Top 0.254: Q3.2 36.23,10.88 36.23,14.5 40.1,18.38 MCP23017.P$15 40.1,18.5 40.1,19.75 MCP23017.P$16 40.1,19.88 40.1,21 MCP23017.P$17 39.98,21.12 38.6,21.12 v38.23,21.5 | v32.48,23.5 30.73,23.5 MCP23017.P$10
  Bottom 0.254: v32.48,23.5 35.1,23.5 37.1,21.5 v38.23,21.5
LOCK_GND
  Top 0.381: Q6.2 62.1,14.38 59.73,16.75 59.73,23.25 59.35,23.62 U$4.1
N$1  (via drill 0.7)
  Top 0.254: v58.1,42.75 60.85,45.5 60.85,46.5 S2.4
  Bottom 0.254: v58.1,42.75 50.85,42.75 49.23,41.12 49.23,40.62 54.85,35 55.35,35 57.54,32.81 | 57.54,32.81 58.6,31.75 58.6,27.88 57.35,26.62 57.35,21 R1.1 | U$1.RST 44.23,32.75 46.85,32.75 48.1,31.5 51.48,31.5 52.73,32.75 57.48,32.75 57.54,32.81
N$2  (via drill 0.7)
  Top 0.381: v55.73,29.75 55.73,28.25 56.73,27.25 56.73,23.25 59.1,20.88 59.1,16.5 59.23,16.38 59.23,12.75 58.35,11.88 58.35,9 54.73,5.38 53.35,5.38 52.23,6.5 51.48,6.5 50.48,5.5 48.35,5.5 R2.2
  Bottom 0.381: v55.73,29.75 55.23,29.75 54.98,30 51.73,30 50.6,28.88 44.23,28.88 U$1.EN
N$3
  Bottom 1: HKLP1.P$1 76.1,8.12 76.72,7.5 X1.1
N$4  (via drill 0.7)
  Top 0.254: v36.23,5.5 38.1,5.5 42.35,9.75 42.35,14.38 R4.2
  Bottom 0.254: v36.23,5.5 23.73,18 23.73,21.62 24.85,22.75 26.1,22.75 U$1.GPIO2
N$5  (via drill 0.7)
  Top 0.254: v87.85,8.25 86.97,7.38 86.35,7.38 R21.2
  Bottom 0.254: v87.85,8.25 91.6,8.25 LM321.3
N$6
  Top 0.381: Q3.1 37.73,11 38.48,11 40.35,9.12 R25.2
N$7
  Bottom 1: HKLP1.P$2 81.1,8.25 81.85,7.5 X1.2
N$8
  Top 0.254: Q1.1 5.47,7.25 5.85,7.25 6.6,6.5 7.1,6.5 8.47,7.88 8.47,9.73 7.92,10.29 7.11,10.29 3.85,13.55 3.85,22.88 2.1,24.62 R15.2
N$9  (via drill 0.7)
  Top 0.254: v38.1,23.62 39.35,22.38 39.98,22.38 MCP23017.P$18 | v36.35,39.88 33.6,42.62 R7.1
  Bottom 0.254: v38.1,23.62 38.1,34.12 38.73,34.75 38.73,37.5 v36.35,39.88
N$12
  Bottom 0.381: MP2014.PG 83.47,28.12 83.47,21.5 82.6,20.62 79.22,20.62 63.98,5.38 R8.2
N$13
  Bottom 0.381: C2.1 81.72,22.25 81.72,26.38 80.97,27.12 80.97,28.12 MP2014.PGDL
N$14  (via drill 0.7, 0.71)
  Top 0.381: v10.6,21.62 10.47,21.75 10.47,23 | 10.47,23 10.22,23.25 LT1571-2.VCC2 | LT1571-2.VCC1 10.72,23.25 10.47,23 | v16.15,7.75 16.15,6.25 D3.C
  Bottom 0.381: v10.6,21.62 10.6,13.5 14.35,9.75 14.35,8 C8.1 16,7.9 v16.15,7.75
N$15  (via drill 0.7)
  Top 0.381: v70.85,32.5 70.85,34.12 65.35,39.62 R16.1
  Bottom 0.381: v70.85,32.5 70.85,37.38 Q2.1
N$16  (via drill 0.7)
  Top 0.381: v63.6,13 63.6,11.5 Q6.1
  Bottom 0.381: v63.6,13 59.73,13 57.6,15.12 R27.2
N$17  (via drill 0.7)
  Top 0.254: v10.22,25 9.6,24.38 9.6,23.5 9.47,23.38 LT1571-2.CAP
  Bottom 0.254: v10.22,25 12.72,22.5 12.72,19 C4.1
N$18  (via drill 0.7)
  Top 0.381: v6.85,7.5 5.6,8.75 5.22,8.75 Q1.2 | R12.2 10.27,2.67 D3.A
  Bottom 0.381: R12.2 10.22,5.25 7.97,7.5 v6.85,7.5 0.97,13.38 0.97,40.38 2.23,41.62 2.23,42.12 R20.2
N$19  (via drill 0.7)
  Top 0.381: 6.6,35.38 7.35,36.12 7.35,44.62 L1.2 | 6.6,35.38 5.72,34.5 5.72,34.12 D1.1 | v8.1,30.62 7.6,30.12 7.6,29 LT1571-2.SENSE | v6.72,35.25 6.6,35.38
  Bottom 0.381: v8.1,30.62 8.1,31.38 6.72,32.75 v6.72,35.25
N$20  (via drill 0.7, 0.71)
  Top 0.381: v11.35,40.88 11.35,44.38 L1.1 | v11.47,30.62 11.47,29 LT1571-2.SW | U$6.C 2.75,38.47 v4.37,40.08
  Bottom 0.381: v11.35,40.88 9.7,39.22 | 9.7,39.22 8.72,38.25 C5.1 8.85,38.12 8.85,34 11.47,31.38 v11.47,30.62 | v4.37,40.08 8.84,40.08 9.7,39.22
N$21  (via drill 0.7)
  Top 0.381: v7.85,34.38 7.85,33.12 D1.3 | v10.72,27.25 10.72,28.88 LT1571-2.BOOST
  Bottom 0.381: C5.2 6.72,38.12 7.85,37 v7.85,34.38 7.97,34.25 7.97,32.38 10.72,29.62 v10.72,27.25
N$22
  Bottom 0.381: C6.2 5.47,19.25 3.23,19.25 2.48,20 R9.2
N$23  (via drill 0.7)
  Top 0.254: v7.47,21.62 8.22,22.38 8.22,23.25 LT1571-2.VC
  Bottom 0.254: v7.47,21.62 7.47,19.25 C6.1
N$24  (via drill 0.7)
  Top 0.381: v11.6,15.5 11.47,15.62 8.1,15.62 R10.2
  Bottom 0.381: v11.6,15.5 12.47,14.62 12.47,14 C7.2
N$25  (via drill 0.7)
  Top 0.254: v11.97,16.88 8.97,19.88 8.97,23.25 LT1571-2.PROG
  Bottom 0.254: R13.2 9.97,9.12 9.97,8.5 12.25,6.22 16.59,6.22 17.52,7.16 17.52,8.61 14.47,11.66 14.47,14 C7.1 14.47,14.12 11.97,16.62 v11.97,16.88
N$26
  Bottom 0.381: 69.85,31.5 67.1,31.5 K1.2 | 69.85,31.5 71.72,31.5 D2.A | 69.85,31.5 69.85,38 70.35,38.5 71.47,38.5 72.35,37.62 72.35,37.25 Q2.2
N$28
  Top 0.381: Q4.1 47.23,10.5 48.23,10.5 49.98,12.25 50.48,12.25 R17.2
N$30
  Bottom 0.254: R22.1 93.35,38.25 93.35,32.38 90.97,30 TX.K
N$31  (via drill 0.7)
  Top 0.381: v55.48,12.62 55.48,11.12 Q5.1
  Bottom 0.381: v55.48,12.62 54.1,12.62 52.1,10.62 51.1,10.62 45.85,5.38 41.98,5.38 R26.2
N$33
  Bottom 0.254: 94.91,15.69 94.22,16.38 R23.1 | 94.91,15.69 95.22,15.38 95.22,11 93.6,9.38 93.6,8.25 LM321.1 | RX.A 92.1,22.5 93.35,23.75 94.22,23.75 94.97,23 94.97,15.75 94.91,15.69
SCL  (via drill 0.7)
  Top 0.254: v32.73,21 30.73,21 MCP23017.P$12 | v64.85,11.12 69.22,6.75 69.22,6.12 R5.2 | v18.35,31.62 v19.73,30.25
  Bottom 0.254: v64.85,11.12 60.6,11.12 57.6,14.12 57.23,14.12 55.6,15.75 55.6,16.75 SV1.7 53.6,18.62 51.23,16.25 50.48,16.25 47.6,13.38 44.6,13.38 43.98,14 43.98,15.75 40.98,18.75 39.73,18.75 37.48,21 v32.73,21 32.73,21.12 31.48,22.38 31.48,32.38 27.85,36 21.6,36 18.35,32.75 v18.35,31.62 | v19.73,30.25 22.73,30.25 24.1,28.88 26.1,28.88 U$1.GPIO5
SDA  (via drill 0.7)
  Top 0.254: MCP23017.P$13 30.6,19.75 30.1,19.75 v27.6,17.25 27.73,17.25 v31.6,13.38 | v51.35,18.25 53.6,16 SV1.8 52.85,16.62 52.85,13.12 49.85,10.12 v49.23,10.12
  Bottom 0.254: v27.6,17.25 27.85,17.25 28.48,17.88 28.48,25.75 27.48,26.75 26.23,26.75 U$1.GPIO4 | R6.2 57.48,31.25 57.48,30.25 54.6,27.38 52.39,27.38 51.84,26.82 51.84,18.74 v51.35,18.25 | v31.6,13.38 32.73,13.38 35.85,10.25 49.1,10.25 v49.23,10.12

### Text on the board
tPlace: IO1 | IO3 | GND
tNames: 3V3 | 14 | A6 | B6 | 12 | A5 | B7 | G | VCC | A4 | GND | V | A3 | G | A2 | 3V3 | V | GND | A1 | A7 | C | A0 | GND | D